# Altium schematic sheet Flow-Sensor.SchDoc
size A; SheetNumber: 12; SheetTotal: 17
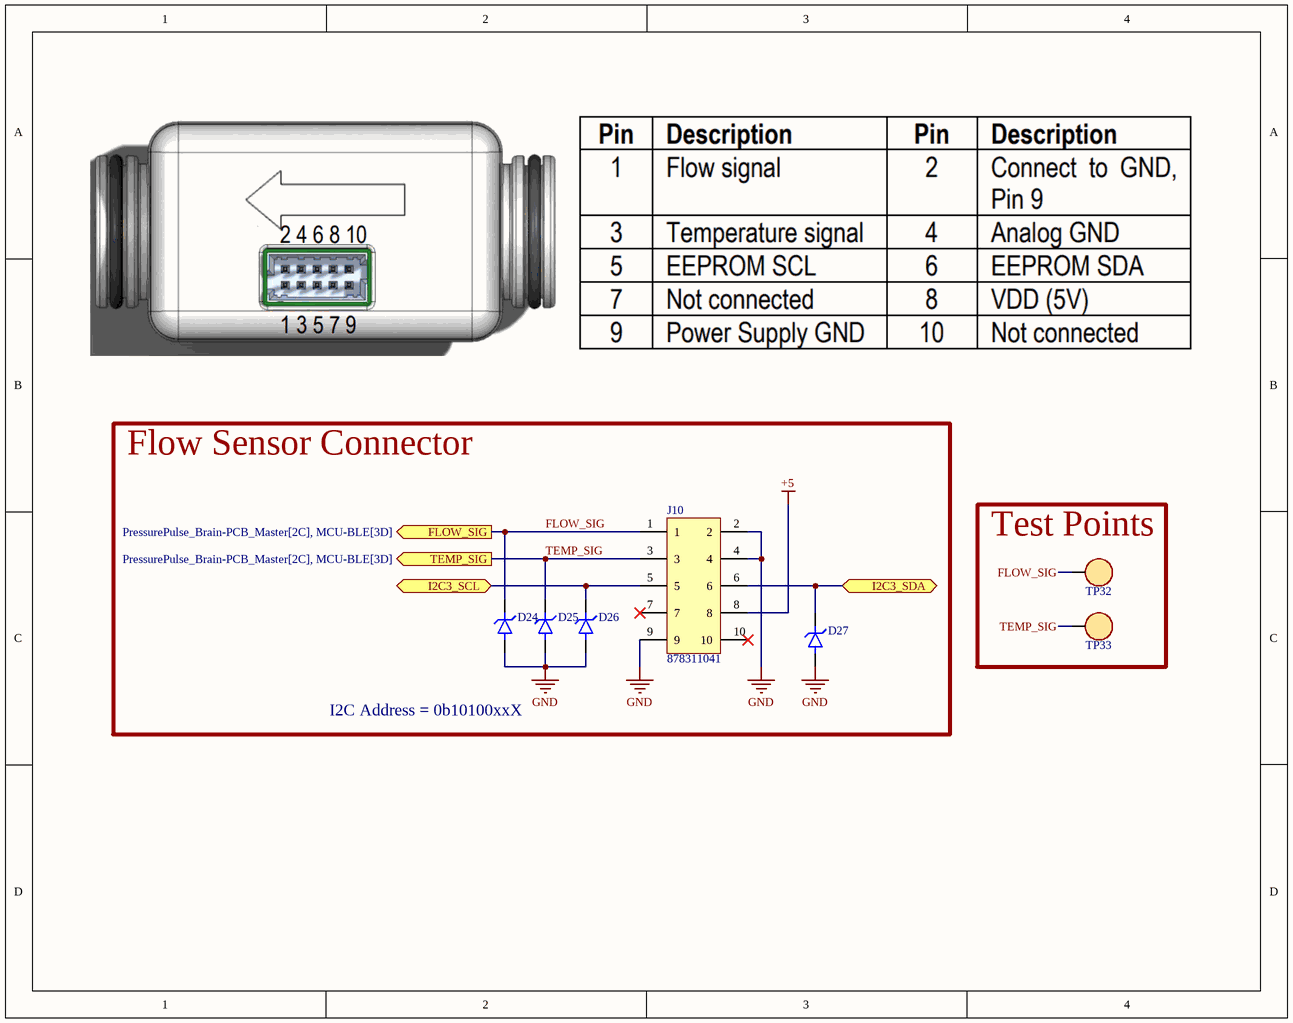
[diagram p0: Flow-Sensor.SchDoc]

## Parts
D24  RCLAMP0521P.TCT  [BDFN2C051V40]  (value not drawn)
D25  RCLAMP0521P.TCT  [BDFN2C051V40]  (value not drawn)
D26  RCLAMP0521P.TCT  [BDFN2C051V40]  (value not drawn)
D27  RCLAMP0521P.TCT  [BDFN2C051V40]  (value not drawn)
J10  878311041  [878311041]
TP32  RH-5019  [TP - RH-5019]  (value not drawn)
TP33  RH-5019  [TP - RH-5019]  (value not drawn)

## Blocks framed on the sheet
Flow Sensor Connector: D24-D27 J10
Test Points: TP32 TP33

## Ports
FLOW_SIG (out, see PressurePulse_Brain-PCB_Master[2C], MCU-BLE[3D]), I2C3_SCL (bidir, see PressurePulse_Brain-PCB_Master[2C], Fuel-Gauge[4B], Gyroscope[1C], MCU-BLE[2D], Pressure-Sensor[1C]), I2C3_SDA (bidir, see PressurePulse_Brain-PCB_Master[2C], Fuel-Gauge[4B], Gyroscope[1C], MCU-BLE[2D], Pressure-Sensor[3C]), TEMP_SIG (out, see PressurePulse_Brain-PCB_Master[2C], MCU-BLE[3D])

## Nets
+5: J10.8
GND: D24.A D25.A D26.A D27.A J10.2 J10.4 J10.9
FLOW_SIG: D24.K J10.1 TP32.1 ; port FLOW_SIG
I2C3_SCL: D26.K J10.5 ; port I2C3_SCL
I2C3_SDA: D27.K J10.6 ; port I2C3_SDA
TEMP_SIG: D25.K J10.3 TP33.1 ; port TEMP_SIG

Not connected (* = marked no-connect by the designer): J10 7* 10*

## Notes on the sheet
- I2C Address = 0b10100xxX

## Library data of the parts
D24-D27 = TVS DIODE: 25V Clamp 4A (8/20µs) Ipp Tvs Diode Surface Mount SLP1006P2; MFR: BORN; Type: SMD; Value: BDFN2C051V40; MFR PN: BDFN2C051V40; JLCPCB PN: C152023
J10 = MOLEX 10 POS 2mm TH: MFR: Molex; Value: DNS; MFR PN: 878311041
TP32 TP33 = TEST POINT: MFR: ronghe; MFR PN: RH-5019; Value: RH-5019; JLCPCB PN: C5199800